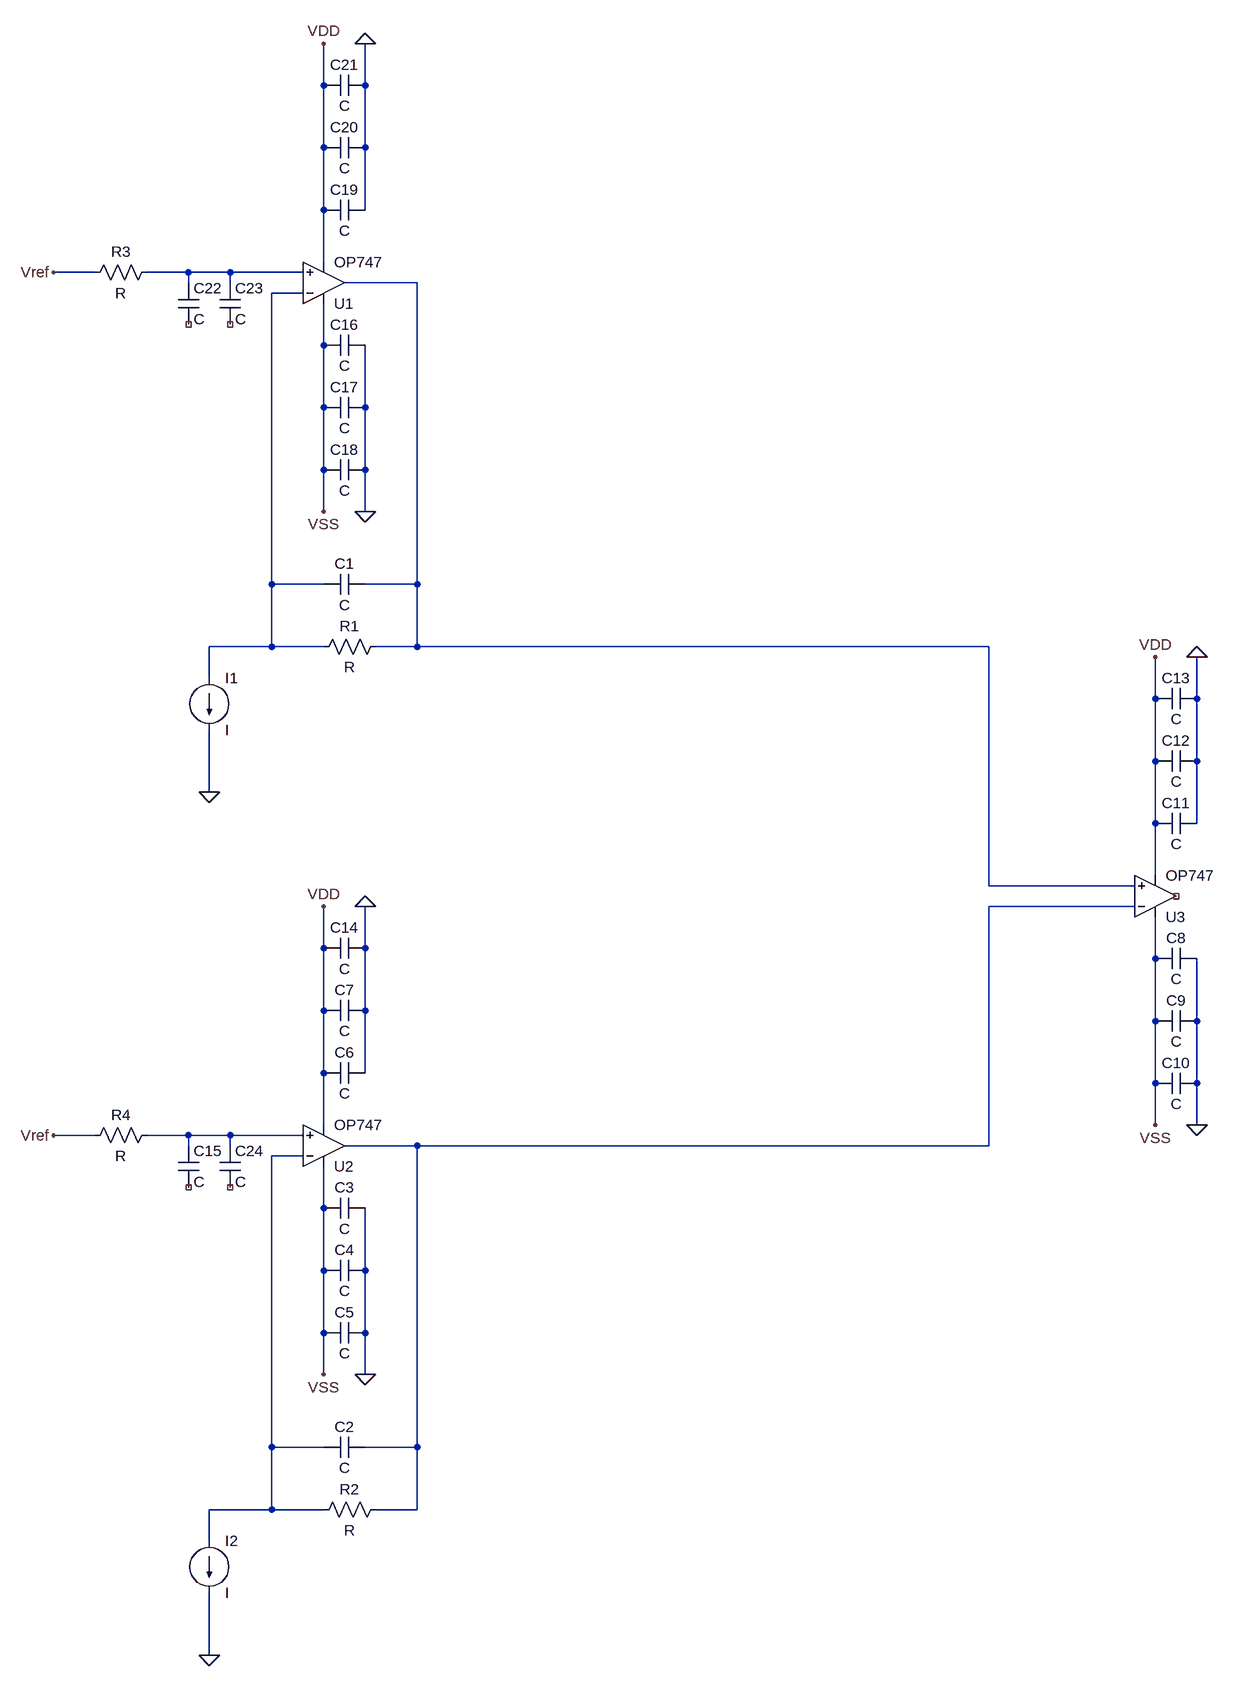
[diagram p0: schematic NoiseAnalysis.asc]
NoiseAnalysis.asc, the LTspice schematic file:
Version 4
SHEET 1 1296 1156
WIRE -80 -1280 -80 -1344
WIRE -16 -1280 -16 -1344
WIRE -80 -1184 -80 -1280
WIRE -16 -1184 -16 -1280
WIRE -80 -1088 -80 -1184
WIRE -16 -1088 -16 -1184
WIRE -80 -1008 -80 -1088
WIRE -432 -992 -496 -992
WIRE -288 -992 -352 -992
WIRE -224 -992 -288 -992
WIRE -112 -992 -224 -992
WIRE -288 -976 -288 -992
WIRE -224 -976 -224 -992
WIRE 64 -976 -48 -976
WIRE -112 -960 -160 -960
WIRE -80 -880 -80 -944
WIRE -80 -784 -80 -880
WIRE -16 -784 -16 -880
WIRE -80 -688 -80 -784
WIRE -16 -688 -16 -784
WIRE -80 -624 -80 -688
WIRE -16 -624 -16 -688
WIRE -160 -512 -160 -960
WIRE -80 -512 -160 -512
WIRE 64 -512 64 -976
WIRE 64 -512 -16 -512
WIRE -160 -416 -160 -512
WIRE -160 -416 -256 -416
WIRE -80 -416 -160 -416
WIRE 64 -416 64 -512
WIRE 64 -416 0 -416
WIRE 944 -416 64 -416
WIRE -256 -368 -256 -416
WIRE 1200 -336 1200 -400
WIRE 1264 -336 1264 -400
WIRE 1200 -240 1200 -336
WIRE 1264 -240 1264 -336
WIRE -256 -192 -256 -288
WIRE 1200 -144 1200 -240
WIRE 1264 -144 1264 -240
WIRE 1200 -64 1200 -144
WIRE 944 -48 944 -416
WIRE 1168 -48 944 -48
WIRE 1168 -16 944 -16
WIRE -80 48 -80 -16
WIRE -16 48 -16 -16
WIRE 1200 64 1200 0
WIRE -80 144 -80 48
WIRE -16 144 -16 48
WIRE 1200 160 1200 64
WIRE 1264 160 1264 64
WIRE -80 240 -80 144
WIRE -16 240 -16 144
WIRE 1200 256 1200 160
WIRE 1264 256 1264 160
WIRE -80 320 -80 240
WIRE 1200 320 1200 256
WIRE 1264 320 1264 256
WIRE -432 336 -496 336
WIRE -288 336 -352 336
WIRE -224 336 -288 336
WIRE -112 336 -224 336
WIRE -288 352 -288 336
WIRE -224 352 -224 336
WIRE 64 352 -48 352
WIRE 944 352 944 -16
WIRE 944 352 64 352
WIRE -112 368 -160 368
WIRE -80 448 -80 384
WIRE -80 544 -80 448
WIRE -16 544 -16 448
WIRE -80 640 -80 544
WIRE -16 640 -16 544
WIRE -80 704 -80 640
WIRE -16 704 -16 640
WIRE -160 816 -160 368
WIRE -80 816 -160 816
WIRE 64 816 64 352
WIRE 64 816 -16 816
WIRE -160 912 -160 816
WIRE -160 912 -256 912
WIRE -80 912 -160 912
WIRE 64 912 64 816
WIRE 64 912 0 912
WIRE -256 960 -256 912
WIRE -256 1136 -256 1040
FLAG 1264 320 0
FLAG 1264 -400 0
FLAG 1200 -400 VDD
FLAG 1200 320 VSS
FLAG -16 -624 0
FLAG -16 -1344 0
FLAG -80 -1344 VDD
FLAG -80 -624 VSS
FLAG -496 -992 Vref
FLAG -256 -192 0
FLAG -16 704 0
FLAG -16 -16 0
FLAG -80 -16 VDD
FLAG -80 704 VSS
FLAG -496 336 Vref
FLAG -256 1136 0
SYMBOL current -256 -368 R0
SYMATTR InstName I1
SYMBOL res 16 -432 R90
WINDOW 0 0 56 VBottom 2
WINDOW 3 32 56 VTop 2
SYMATTR InstName R1
SYMBOL cap -16 -528 R90
WINDOW 0 0 32 VBottom 2
WINDOW 3 32 32 VTop 2
SYMATTR InstName C1
SYMBOL cap 1264 48 R90
WINDOW 0 0 32 VBottom 2
WINDOW 3 32 32 VTop 2
SYMATTR InstName C8
SYMBOL cap 1264 144 R90
WINDOW 0 0 32 VBottom 2
WINDOW 3 32 32 VTop 2
SYMATTR InstName C9
SYMBOL cap 1264 240 R90
WINDOW 0 0 32 VBottom 2
WINDOW 3 32 32 VTop 2
SYMATTR InstName C10
SYMBOL cap 1264 -128 M270
WINDOW 0 32 32 VTop 2
WINDOW 3 0 32 VBottom 2
SYMATTR InstName C11
SYMBOL cap 1264 -224 M270
WINDOW 0 32 32 VTop 2
WINDOW 3 0 32 VBottom 2
SYMATTR InstName C12
SYMBOL cap 1264 -320 M270
WINDOW 0 32 32 VTop 2
WINDOW 3 0 32 VBottom 2
SYMATTR InstName C13
SYMBOL Opamps\\OP747 1200 32 M180
SYMATTR InstName U3
SYMBOL cap -16 -896 R90
WINDOW 0 0 32 VBottom 2
WINDOW 3 32 32 VTop 2
SYMATTR InstName C16
SYMBOL cap -16 -800 R90
WINDOW 0 0 32 VBottom 2
WINDOW 3 32 32 VTop 2
SYMATTR InstName C17
SYMBOL cap -16 -704 R90
WINDOW 0 0 32 VBottom 2
WINDOW 3 32 32 VTop 2
SYMATTR InstName C18
SYMBOL cap -16 -1072 M270
WINDOW 0 32 32 VTop 2
WINDOW 3 0 32 VBottom 2
SYMATTR InstName C19
SYMBOL cap -16 -1168 M270
WINDOW 0 32 32 VTop 2
WINDOW 3 0 32 VBottom 2
SYMATTR InstName C20
SYMBOL cap -16 -1264 M270
WINDOW 0 32 32 VTop 2
WINDOW 3 0 32 VBottom 2
SYMATTR InstName C21
SYMBOL Opamps\\OP747 -80 -912 M180
SYMATTR InstName U1
SYMBOL res -336 -1008 R90
WINDOW 0 0 56 VBottom 2
WINDOW 3 32 56 VTop 2
SYMATTR InstName R3
SYMBOL cap -304 -976 R0
SYMATTR InstName C22
SYMBOL cap -240 -976 R0
SYMATTR InstName C23
SYMBOL current -256 960 R0
SYMATTR InstName I2
SYMBOL res 16 896 R90
WINDOW 0 0 56 VBottom 2
WINDOW 3 32 56 VTop 2
SYMATTR InstName R2
SYMBOL cap -16 800 R90
WINDOW 0 0 32 VBottom 2
WINDOW 3 32 32 VTop 2
SYMATTR InstName C2
SYMBOL cap -16 432 R90
WINDOW 0 0 32 VBottom 2
WINDOW 3 32 32 VTop 2
SYMATTR InstName C3
SYMBOL cap -16 528 R90
WINDOW 0 0 32 VBottom 2
WINDOW 3 32 32 VTop 2
SYMATTR InstName C4
SYMBOL cap -16 624 R90
WINDOW 0 0 32 VBottom 2
WINDOW 3 32 32 VTop 2
SYMATTR InstName C5
SYMBOL cap -16 256 M270
WINDOW 0 32 32 VTop 2
WINDOW 3 0 32 VBottom 2
SYMATTR InstName C6
SYMBOL cap -16 160 M270
WINDOW 0 32 32 VTop 2
WINDOW 3 0 32 VBottom 2
SYMATTR InstName C7
SYMBOL cap -16 64 M270
WINDOW 0 32 32 VTop 2
WINDOW 3 0 32 VBottom 2
SYMATTR InstName C14
SYMBOL Opamps\\OP747 -80 416 M180
SYMATTR InstName U2
SYMBOL res -336 320 R90
WINDOW 0 0 56 VBottom 2
WINDOW 3 32 56 VTop 2
SYMATTR InstName R4
SYMBOL cap -304 352 R0
SYMATTR InstName C15
SYMBOL cap -240 352 R0
SYMATTR InstName C24

The netlist it stands for:
* NoiseAnalysis.asc
I1 N003 0 I
R1 N002 N003 R
C1 N002 N003 C
C8 0 VSS C
C9 0 VSS C
C10 0 VSS C
C11 0 VDD C
C12 0 VDD C
C13 0 VDD C
XU3 N002 N004 VSS VDD NC_01 OP747  ; pins In+ In- V+ V- OUT
C16 0 VSS C
C17 0 VSS C
C18 0 VSS C
C19 0 VDD C
C20 0 VDD C
C21 0 VDD C
XU1 N001 N003 VSS VDD N002 OP747  ; pins In+ In- V+ V- OUT
R3 N001 Vref R
C22 N001 NC_02 C
C23 N001 NC_03 C
I2 N006 0 I
R2 N004 N006 R
C2 N004 N006 C
C3 0 VSS C
C4 0 VSS C
C5 0 VSS C
C6 0 VDD C
C7 0 VDD C
C14 0 VDD C
XU2 N005 N006 VSS VDD N004 OP747  ; pins In+ In- V+ V- OUT
R4 N005 Vref R
C15 N005 NC_04 C
C24 N005 NC_05 C
.backanno
.end